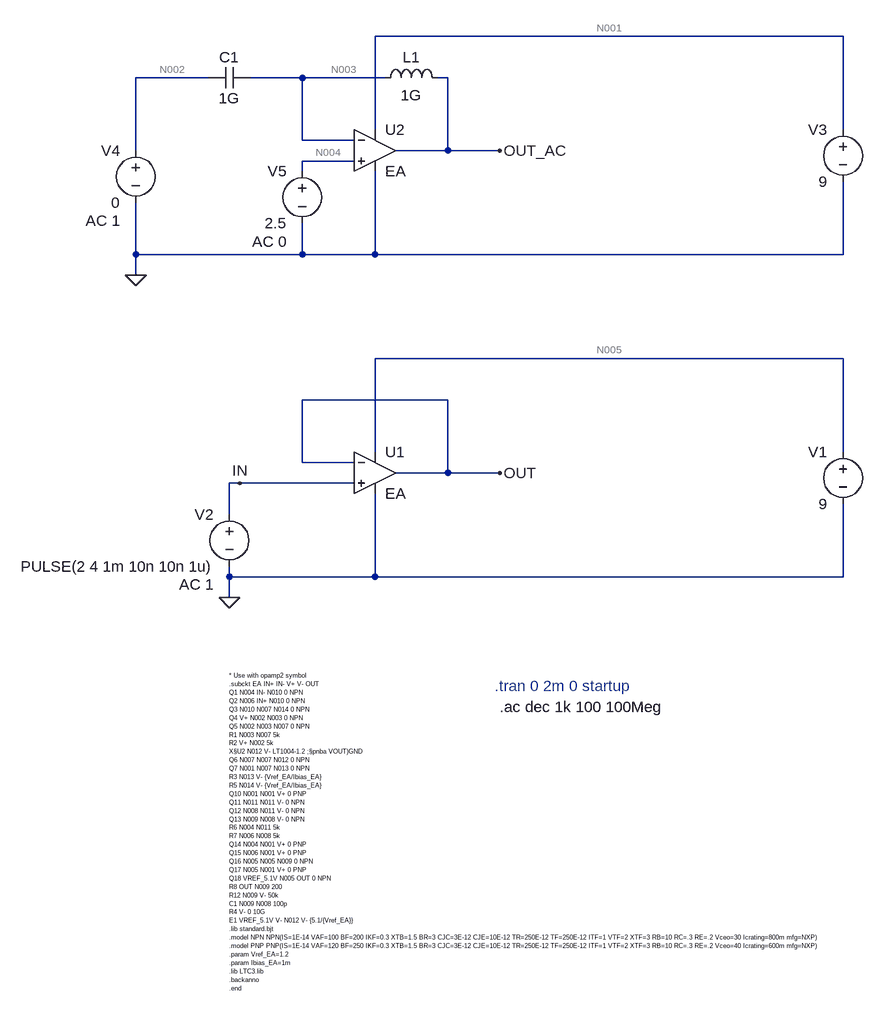
[diagram p0: schematic Err_Amp_Test_Bench.asc]
Err_Amp_Test_Bench.asc, the LTspice schematic file:
Version 4.1
SHEET 1 2268 1200
WIRE 1200 -1104 480 -1104
WIRE 224 -1040 112 -1040
WIRE 368 -1040 288 -1040
WIRE 496 -1040 368 -1040
WIRE 592 -1040 576 -1040
WIRE 480 -960 480 -1104
WIRE 1200 -960 1200 -1104
WIRE 368 -944 368 -1040
WIRE 448 -944 368 -944
WIRE 112 -928 112 -1040
WIRE 592 -928 592 -1040
WIRE 592 -928 512 -928
WIRE 672 -928 592 -928
WIRE 448 -912 368 -912
WIRE 368 -896 368 -912
WIRE 112 -768 112 -848
WIRE 368 -768 368 -816
WIRE 368 -768 112 -768
WIRE 480 -768 480 -896
WIRE 480 -768 368 -768
WIRE 1200 -768 1200 -880
WIRE 1200 -768 480 -768
WIRE 112 -736 112 -768
WIRE 1200 -608 480 -608
WIRE 592 -544 368 -544
WIRE 480 -464 480 -608
WIRE 1200 -464 1200 -608
WIRE 368 -448 368 -544
WIRE 448 -448 368 -448
WIRE 592 -432 592 -544
WIRE 592 -432 512 -432
WIRE 672 -432 592 -432
WIRE 272 -416 256 -416
WIRE 448 -416 272 -416
WIRE 256 -368 256 -416
WIRE 256 -272 256 -288
WIRE 480 -272 480 -400
WIRE 480 -272 256 -272
WIRE 1200 -272 1200 -384
WIRE 1200 -272 480 -272
WIRE 256 -240 256 -272
FLAG 256 -240 0
FLAG 672 -432 OUT
FLAG 272 -416 IN
FLAG 112 -736 0
FLAG 672 -928 OUT_AC
SYMBOL OpAmps\\opamp2 480 -496 R0
SYMATTR InstName U1
SYMATTR Value EA
SYMBOL voltage 1200 -480 M0
WINDOW 123 0 0 Left 0
WINDOW 39 0 0 Left 0
SYMATTR InstName V1
SYMATTR Value 9
SYMBOL voltage 256 -384 M0
WINDOW 123 24 124 Left 2
WINDOW 39 0 0 Left 0
SYMATTR Value2 AC 1
SYMATTR InstName V2
SYMATTR Value PULSE(2 4 1m 10n 10n 1u)
SYMBOL OpAmps\\opamp2 480 -992 R0
SYMATTR InstName U2
SYMATTR Value EA
SYMBOL voltage 1200 -976 M0
WINDOW 123 0 0 Left 0
WINDOW 39 0 0 Left 0
SYMATTR InstName V3
SYMATTR Value 9
SYMBOL voltage 112 -944 M0
WINDOW 123 24 124 Left 2
WINDOW 39 0 0 Left 0
SYMATTR Value2 AC 1
SYMATTR InstName V4
SYMATTR Value 0
SYMBOL voltage 368 -912 M0
WINDOW 123 24 124 Left 2
WINDOW 39 0 0 Left 0
SYMATTR Value2 AC 0
SYMATTR InstName V5
SYMATTR Value 2.5
SYMBOL ind 480 -1024 R270
WINDOW 0 32 56 VTop 2
WINDOW 3 5 56 VBottom 2
SYMATTR InstName L1
SYMATTR Value 1G
SYMBOL cap 288 -1056 R90
WINDOW 0 0 32 VBottom 2
WINDOW 3 32 32 VTop 2
SYMATTR InstName C1
SYMATTR Value 1G
TEXT 256 -120 Left 0 !* Use with opamp2 symbol\n.subckt EA IN+ IN- V+ V- OUT\nQ1 N004 IN- N010 0 NPN\nQ2 N006 IN+ N010 0 NPN\nQ3 N010 N007 N014 0 NPN\nQ4 V+ N002 N003 0 NPN\nQ5 N002 N003 N007 0 NPN\nR1 N003 N007 5k\nR2 V+ N002 5k\nX§U2 N012 V- LT1004-1.2 ;§pnba VOUT)GND\nQ6 N007 N007 N012 0 NPN\nQ7 N001 N007 N013 0 NPN\nR3 N013 V- {Vref_EA/Ibias_EA}\nR5 N014 V- {Vref_EA/Ibias_EA}\nQ10 N001 N001 V+ 0 PNP\nQ11 N011 N011 V- 0 NPN\nQ12 N008 N011 V- 0 NPN\nQ13 N009 N008 V- 0 NPN\nR6 N004 N011 5k\nR7 N006 N008 5k\nQ14 N004 N001 V+ 0 PNP\nQ15 N006 N001 V+ 0 PNP\nQ16 N005 N005 N009 0 NPN\nQ17 N005 N001 V+ 0 PNP\nQ18 VREF_5.1V N005 OUT 0 NPN\nR8 OUT N009 200\nR12 N009 V- 50k\nC1 N009 N008 100p\nR4 V- 0 10G\nE1 VREF_5.1V V- N012 V- {5.1/{Vref_EA}}\n.lib standard.bjt\n.model NPN NPN(IS=1E-14 VAF=100 BF=200 IKF=0.3 XTB=1.5 BR=3 CJC=3E-12 CJE=10E-12 TR=250E-12 TF=250E-12 ITF=1 VTF=2 XTF=3 RB=10 RC=.3 RE=.2 Vceo=30 Icrating=800m mfg=NXP)\n.model PNP PNP(IS=1E-14 VAF=120 BF=250 IKF=0.3 XTB=1.5 BR=3 CJC=3E-12 CJE=10E-12 TR=250E-12 TF=250E-12 ITF=1 VTF=2 XTF=3 RB=10 RC=.3 RE=.2 Vceo=40 Icrating=600m mfg=NXP)\n.param Vref_EA=1.2\n.param Ibias_EA=1m\n.lib LTC3.lib\n.backanno\n.end
TEXT 664 -104 Left 2 ;.tran 0 2m 0 startup
TEXT 672 -72 Left 2 !.ac dec 1k 100 100Meg

The netlist it stands for:
* Err_Amp_Test_Bench.asc
X§U1 IN OUT N005 0 OUT EA  ; pins In+ In- V+ V- OUT
V1 N005 0 9
V2 IN 0 PULSE(2 4 1m 10n 10n 1u) AC 1
X§U2 N004 N003 N001 0 OUT_AC EA  ; pins In+ In- V+ V- OUT
V3 N001 0 9
V4 N002 0 0 AC 1
V5 N004 0 2.5 AC 0
L1 N003 OUT_AC 1G
C1 N003 N002 1G
* Use with opamp2 symbol
.subckt EA IN+ IN- V+ V- OUT
Q1 N004 IN- N010 0 NPN
Q2 N006 IN+ N010 0 NPN
Q3 N010 N007 N014 0 NPN
Q4 V+ N002 N003 0 NPN
Q5 N002 N003 N007 0 NPN
R1 N003 N007 5k
R2 V+ N002 5k
X§U2 N012 V- LT1004-1.2 ;§pnba VOUT)GND
Q6 N007 N007 N012 0 NPN
Q7 N001 N007 N013 0 NPN
R3 N013 V- {Vref_EA/Ibias_EA}
R5 N014 V- {Vref_EA/Ibias_EA}
Q10 N001 N001 V+ 0 PNP
Q11 N011 N011 V- 0 NPN
Q12 N008 N011 V- 0 NPN
Q13 N009 N008 V- 0 NPN
R6 N004 N011 5k
R7 N006 N008 5k
Q14 N004 N001 V+ 0 PNP
Q15 N006 N001 V+ 0 PNP
Q16 N005 N005 N009 0 NPN
Q17 N005 N001 V+ 0 PNP
Q18 VREF_5.1V N005 OUT 0 NPN
R8 OUT N009 200
R12 N009 V- 50k
C1 N009 N008 100p
R4 V- 0 10G
E1 VREF_5.1V V- N012 V- {5.1/{Vref_EA}}
.lib standard.bjt
.model NPN NPN(IS=1E-14 VAF=100 BF=200 IKF=0.3 XTB=1.5 BR=3 CJC=3E-12 CJE=10E-12 TR=250E-12 TF=250E-12 ITF=1 VTF=2 XTF=3 RB=10 RC=.3 RE=.2 Vceo=30 Icrating=800m mfg=NXP)
.model PNP PNP(IS=1E-14 VAF=120 BF=250 IKF=0.3 XTB=1.5 BR=3 CJC=3E-12 CJE=10E-12 TR=250E-12 TF=250E-12 ITF=1 VTF=2 XTF=3 RB=10 RC=.3 RE=.2 Vceo=40 Icrating=600m mfg=NXP)
.param Vref_EA=1.2
.param Ibias_EA=1m
.lib LTC3.lib
.backanno
.end
* .tran 0 2m 0 startup
.ac dec 1k 100 100Meg
.backanno
.end